# EAGLE schematic Dual LPF Schematic (EAGLE 9.3.0)

## Sheet 1 of 2
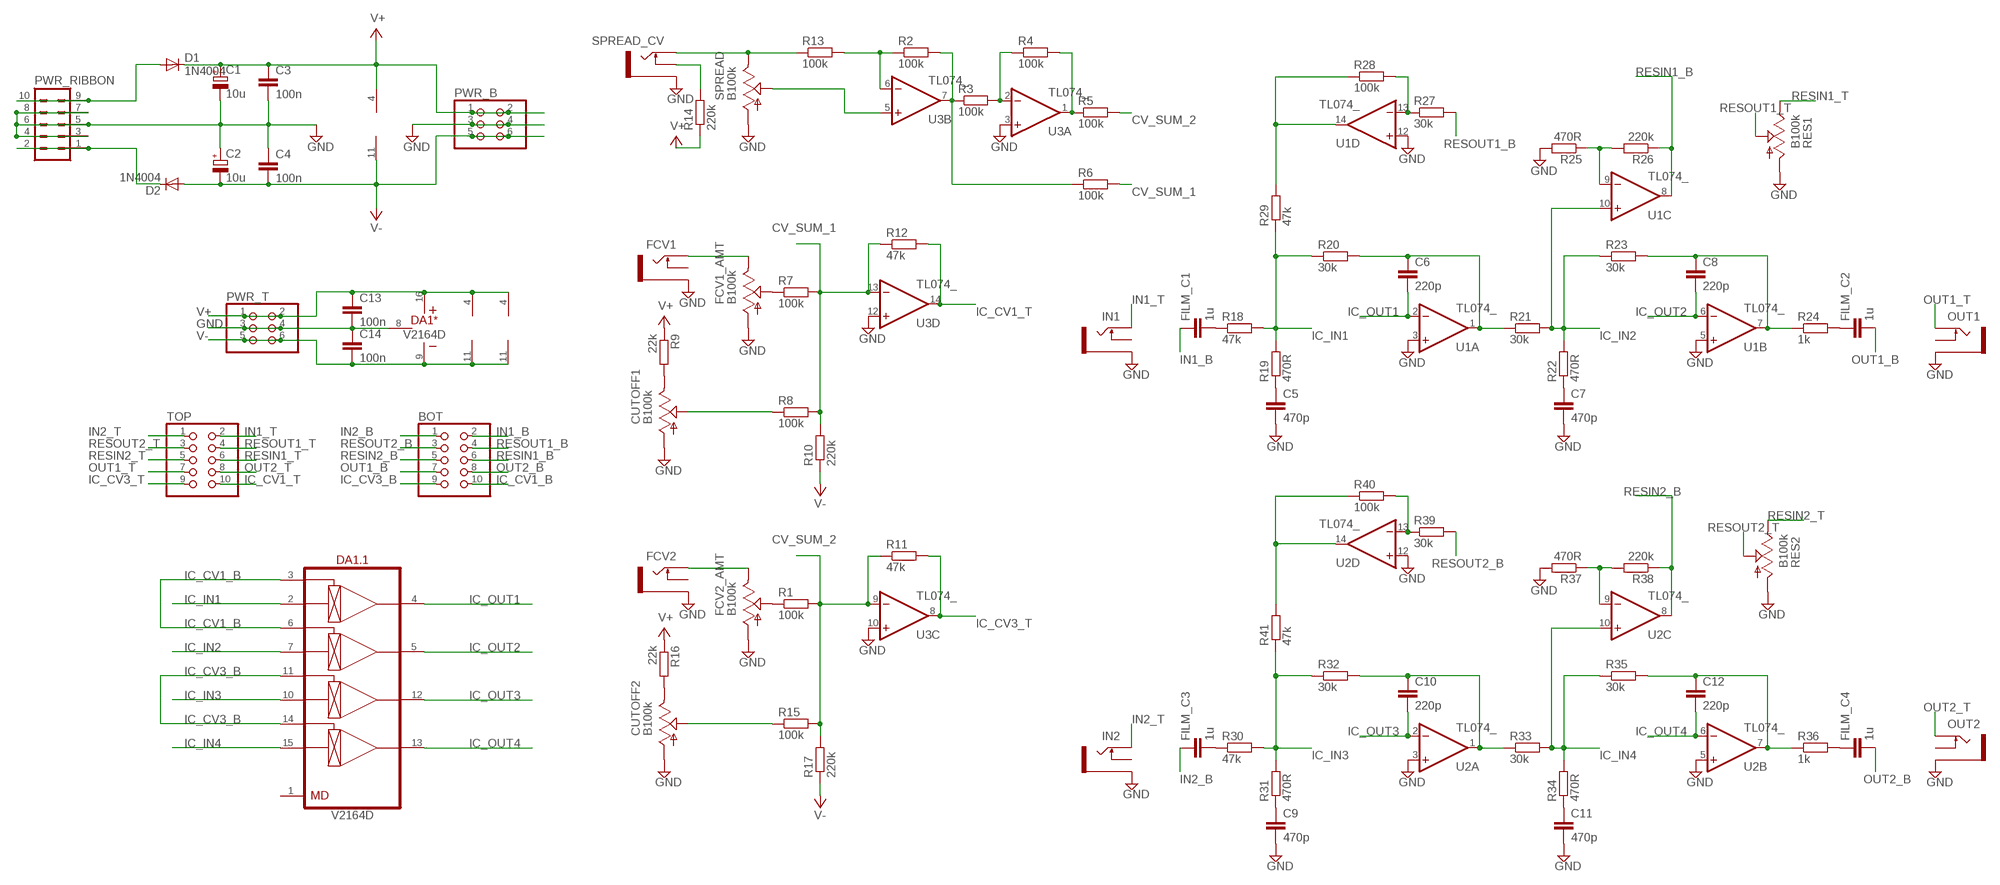
[diagram p0: schematic, sheet 1]

### Parts
BOT  PINHD-2X5  [2X05]
C1  10u  CPOL-EUE5-10.5  [E5-10,5]
C2  10u  CPOL-EUE5-10.5  [E5-10,5]
C3  100n  C-EU050-024X044  [C050-024X044]
C4  100n  C-EU050-024X044  [C050-024X044]
C5  470p  C-EU050-024X044  [C050-024X044]
C6  220p  C-EU050-024X044  [C050-024X044]
C7  470p  C-EU050-024X044  [C050-024X044]
C8  220p  C-EU050-024X044  [C050-024X044]
C9  470p  C-EU050-024X044  [C050-024X044]
C10  220p  C-EU050-024X044  [C050-024X044]
C11  470p  C-EU050-024X044  [C050-024X044]
C12  220p  C-EU050-024X044  [C050-024X044]
C13  100n  C-EU050-024X044  [C050-024X044]
C14  100n  C-EU050-024X044  [C050-024X044]
CUTOFF1  B100k  9MM_SNAP-IN_POT_  [9MM_SNAP-IN_POT]
CUTOFF2  B100k  9MM_SNAP-IN_POT_  [9MM_SNAP-IN_POT]
D1  1N4004  [DO41-10]
D2  1N4004  [DO41-10]
DA1  V2164D  [DIP-16]
FCV1  THONKICONNNEW  [WQP-PJ301M-12_JACK]
FCV1_AMT  B100k  9MM_SNAP-IN_POT_  [9MM_SNAP-IN_POT]
FCV2  THONKICONNNEW  [WQP-PJ301M-12_JACK]
FCV2_AMT  B100k  9MM_SNAP-IN_POT_  [9MM_SNAP-IN_POT]
FILM_C1  1u  C-EU050-045X075  [C050-045X075]
FILM_C2  1u  C-EU050-045X075  [C050-045X075]
FILM_C3  1u  C-EU050-045X075  [C050-045X075]
FILM_C4  1u  C-EU050-045X075  [C050-045X075]
IN1  THONKICONNNEW  [WQP-PJ301M-12_JACK]
IN2  THONKICONNNEW  [WQP-PJ301M-12_JACK]
OUT1  THONKICONNNEW  [WQP-PJ301M-12_JACK]
OUT2  THONKICONNNEW  [WQP-PJ301M-12_JACK]
PWR_B  PINHD-2X3  [2X03]
PWR_RIBBON  EURO_POWER_HEADERFAT_PADS  [EURO_PWR_HEADER_FAT]
PWR_T  PINHD-2X3  [2X03]
R1  100k  R-EU_0207/7  [0207/7]
R2  100k  R-EU_0207/7  [0207/7]
R3  100k  R-EU_0207/7  [0207/7]
R4  100k  R-EU_0207/7  [0207/7]
R5  100k  R-EU_0207/7  [0207/7]
R6  100k  R-EU_0207/7  [0207/7]
R7  100k  R-EU_0207/7  [0207/7]
R8  100k  R-EU_0207/7  [0207/7]
R9  22k  R-EU_0207/7  [0207/7]
R10  220k  R-EU_0207/7  [0207/7]
R11  47k  R-EU_0207/7  [0207/7]
R12  47k  R-EU_0207/7  [0207/7]
R13  100k  R-EU_0207/7  [0207/7]
R14  220k  R-EU_0207/7  [0207/7]
R15  100k  R-EU_0207/7  [0207/7]
R16  22k  R-EU_0207/7  [0207/7]
R17  220k  R-EU_0207/7  [0207/7]
R18  47k  R-EU_0207/7  [0207/7]
R19  470R  R-EU_0207/7  [0207/7]
R20  30k  R-EU_0207/7  [0207/7]
R21  30k  R-EU_0207/7  [0207/7]
R22  470R  R-EU_0207/7  [0207/7]
R23  30k  R-EU_0207/7  [0207/7]
R24  1k  R-EU_0207/7  [0207/7]
R25  470R  R-EU_0207/7  [0207/7]
R26  220k  R-EU_0207/7  [0207/7]
R27  30k  R-EU_0207/7  [0207/7]
R28  100k  R-EU_0207/7  [0207/7]
R29  47k  R-EU_0207/7  [0207/7]
R30  47k  R-EU_0207/7  [0207/7]
R31  470R  R-EU_0207/7  [0207/7]
R32  30k  R-EU_0207/7  [0207/7]
R33  30k  R-EU_0207/7  [0207/7]
R34  470R  R-EU_0207/7  [0207/7]
R35  30k  R-EU_0207/7  [0207/7]
R36  1k  R-EU_0207/7  [0207/7]
R37  470R  R-EU_0207/7  [0207/7]
R38  220k  R-EU_0207/7  [0207/7]
R39  30k  R-EU_0207/7  [0207/7]
R40  100k  R-EU_0207/7  [0207/7]
R41  47k  R-EU_0207/7  [0207/7]
RES1  B100k  9MM_SNAP-IN_POT_  [9MM_SNAP-IN_POT]
RES2  B100k  9MM_SNAP-IN_POT_  [9MM_SNAP-IN_POT]
SPREAD  B100k  9MM_SNAP-IN_POT_  [9MM_SNAP-IN_POT]
SPREAD_CV  THONKICONNNEW  [WQP-PJ301M-12_JACK]
TOP  PINHD-2X5  [2X05]
U1  TL074_  [DIL14]
U2  TL074_  [DIL14]
U3  TL074_  [DIL14]

### Nets
CV_SUM_1: R6.2 R7.2 R8.2 R10.2 R12.1 U3.13(D:-IN)
CV_SUM_2: R1.2 R5.2 R11.1 R15.2 R17.2 U3.9(C:-IN)
GND: C1.- C2.+ C3.2 C4.1 C5.2 C7.2 C9.2 C11.2 C13.2 C14.1 CUTOFF1.1(A) CUTOFF2.1(A) DA1.8(*:GND) FCV1.P$3_SLEEVE(SLEEVE) FCV1_AMT.1(A) FCV2.P$3_SLEEVE(SLEEVE) FCV2_AMT.1(A) IN1.P$3_SLEEVE(SLEEVE) IN2.P$3_SLEEVE(SLEEVE) OUT1.P$3_SLEEVE(SLEEVE) OUT2.P$3_SLEEVE(SLEEVE) PWR_B.3 PWR_B.4 PWR_RIBBON.3 PWR_RIBBON.4 PWR_RIBBON.5 PWR_RIBBON.6 PWR_RIBBON.7 PWR_RIBBON.8 PWR_T.3 PWR_T.4 R25.2 R37.2 RES1.1(A) RES2.1(A) SPREAD.1(A) SPREAD_CV.P$3_SLEEVE(SLEEVE) U1.3(A:+IN) U1.5(B:+IN) U1.12(D:+IN) U2.3(A:+IN) U2.5(B:+IN) U2.12(D:+IN) U3.3(A:+IN) U3.10(C:+IN) U3.12(D:+IN)
IC_CV1_B: BOT.10 DA1.3(.1:CV1) DA1.6(.1:CV2)
IC_CV1_T: R12.2 TOP.10 U3.14(D:OUT)
IC_CV3_B: BOT.9 DA1.11(.1:CV3) DA1.14(.1:CV4)
IC_CV3_T: R11.2 TOP.9 U3.8(C:OUT)
IC_IN1: DA1.2(.1:IN1) R18.2 R19.2 R20.1 R29.1
IC_IN2: DA1.7(.1:IN2) R21.2 R22.2 R23.1 U1.10(C:+IN)
IC_IN3: DA1.10(.1:IN3) R30.2 R31.2 R32.1 R41.1
IC_IN4: DA1.15(.1:IN4) R33.2 R34.2 R35.1 U2.10(C:+IN)
IC_OUT1: C6.2 DA1.4(.1:OUT1) U1.2(A:-IN)
IC_OUT2: C8.2 DA1.5(.1:OUT2) U1.6(B:-IN)
IC_OUT3: C10.2 DA1.12(.1:OUT3) U2.2(A:-IN)
IC_OUT4: C12.2 DA1.13(.1:OUT4) U2.6(B:-IN)
IN1_B: BOT.2 FILM_C1.1
IN1_T: IN1.P$1_TIP(TIP) TOP.2
IN2_B: BOT.1 FILM_C3.1
IN2_T: IN2.P$1_TIP(TIP) TOP.1
N$1: FCV2_AMT.2(S) R1.1
N$2: R2.1 R13.2 U3.6(B:-IN)
N$3: R2.2 R3.1 R6.1 U3.7(B:OUT)
N$4: R3.2 R4.1 U3.2(A:-IN)
N$5: R4.2 R5.1 U3.1(A:OUT)
N$6: R14.2 SPREAD_CV.P$2_SWITCH(SWITCH)
N$7: SPREAD.2(S) U3.5(B:+IN)
N$8: R13.1 SPREAD.3(E) SPREAD_CV.P$1_TIP(TIP)
N$9: FCV1_AMT.2(S) R7.1
N$10: CUTOFF1.2(S) R8.1
N$11: FCV1.P$1_TIP(TIP) FCV1_AMT.3(E)
N$12: CUTOFF1.3(E) R9.2
N$14: C6.1 R20.2 R21.1 U1.1(A:OUT)
N$15: CUTOFF2.2(S) R15.1
N$16: CUTOFF2.3(E) R16.2
N$17: FCV2.P$1_TIP(TIP) FCV2_AMT.3(E)
N$18: FILM_C1.2 R18.1
N$19: C5.1 R19.1
N$20: C7.1 R22.1
N$21: C8.1 R23.2 R24.1 U1.7(B:OUT)
N$22: FILM_C2.1 R24.2
N$25: R25.1 R26.2 U1.9(C:-IN)
N$26: R28.1 R29.2 U1.14(D:OUT)
N$28: R27.1 R28.2 U1.13(D:-IN)
N$30: D1.A PWR_RIBBON.9 PWR_RIBBON.10
N$32: FILM_C3.2 R30.1
N$33: C9.1 R31.1
N$34: C10.1 R32.2 R33.1 U2.1(A:OUT)
N$35: C11.1 R34.1
N$36: C12.1 R35.2 R36.1 U2.7(B:OUT)
N$37: FILM_C4.1 R36.2
N$38: D2.C PWR_RIBBON.1 PWR_RIBBON.2
N$40: R37.1 R38.2 U2.9(C:-IN)
N$42: R39.1 R40.2 U2.13(D:-IN)
N$43: R40.1 R41.2 U2.14(D:OUT)
OUT1_B: BOT.7 FILM_C2.2
OUT1_T: OUT1.P$1_TIP(TIP) TOP.7
OUT2_B: BOT.8 FILM_C4.2
OUT2_T: OUT2.P$1_TIP(TIP) TOP.8
RESIN1_B: BOT.6 R26.1 U1.8(C:OUT)
RESIN1_T: RES1.3(E) TOP.6
RESIN2_B: BOT.5 R38.1 U2.8(C:OUT)
RESIN2_T: RES2.3(E) TOP.5
RESOUT1_B: BOT.4 R27.2
RESOUT1_T: RES1.2(S) TOP.4
RESOUT2_B: BOT.3 R39.2
RESOUT2_T: RES2.2(S) TOP.3
V+: C1.+ C3.1 C13.1 D1.C DA1.16(*:V+) PWR_B.1 PWR_B.2 PWR_T.1 PWR_T.2 R9.1 R14.1 R16.1 U1.4(P:V+) U2.4(P:V+) U3.4(P:V+)
V-: C2.- C4.2 C14.2 D2.A DA1.9(*:V-) PWR_B.5 PWR_B.6 PWR_T.5 PWR_T.6 R10.1 R17.1 U1.11(P:V-) U2.11(P:V-) U3.11(P:V-)
Unconnected: DA1.1(.1:MD) FCV1.P$2_SWITCH(SWITCH) FCV2.P$2_SWITCH(SWITCH) IN1.P$2_SWITCH(SWITCH) IN2.P$2_SWITCH(SWITCH) OUT1.P$2_SWITCH(SWITCH) OUT2.P$2_SWITCH(SWITCH)

## Sheet 2 of 2

## Library data of the parts
BOT TOP = pinhead:PINHD-2X5: PIN HEADER
C1 C2 = resistor:CPOL-EU: POLARIZED CAPACITOR, European symbol
C3-C14 FILM_C1-FILM_C4 = resistor:C-EU: CAPACITOR, European symbol
CUTOFF1 CUTOFF2 FCV1_AMT FCV2_AMT RES1 RES2 SPREAD = MusicThingModular:9MM_SNAP-IN_POT: 9mm vertical snap-in pot, Alpha / Panasonic style
D1 D2 = diode:1N4004: DIODE general purpose rectifier, 1 A
DA1 = ic-coolaudio:V2164
FCV1 FCV2 IN1 IN2 OUT1 OUT2 SPREAD_CV = MusicThingModular:THONKICONN: 3.5mm socket for Eurorack modular synths
PWR_B PWR_T = pinhead:PINHD-2X3: PIN HEADER
PWR_RIBBON = MusicThingModular:EURO_POWER_HEADER: Power Header 10 pin power header for Eurorack Power Supplies Variants with fatter pads for easier soldering, and the LOCK variant which has 5mil offset pins to hold the component in place before soldering
R1-R41 = resistor:R-EU_: RESISTOR, European symbol
U1-U3 = MusicThingModular:TL074: Generic Quad Op Amp